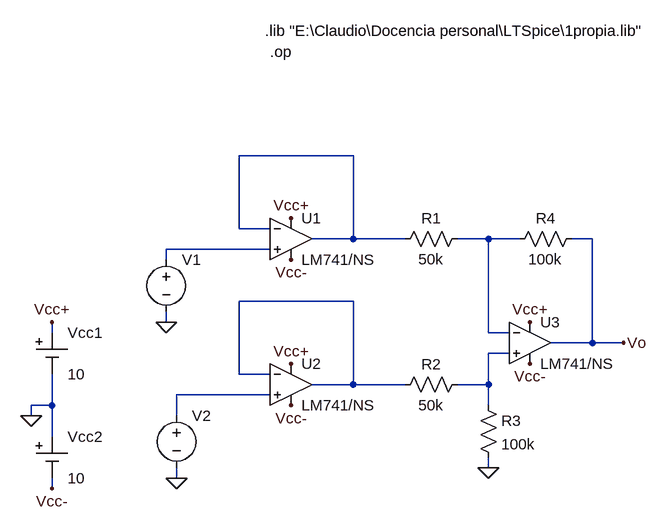
[diagram p0: schematic p2e1.asc]
p2e1.asc, the LTspice schematic file:
Version 4
SHEET 1 1508 1252
WIRE 352 -192 176 -192
WIRE 176 -80 176 -192
WIRE 224 -80 176 -80
WIRE 352 -64 352 -192
WIRE 352 -64 288 -64
WIRE 432 -64 352 -64
WIRE 560 -64 512 -64
WIRE 608 -64 560 -64
WIRE 720 -64 688 -64
WIRE 224 -48 64 -48
WIRE 64 -32 64 -48
WIRE 352 32 176 32
WIRE 64 64 64 48
WIRE -112 80 -112 64
WIRE 560 80 560 -64
WIRE 592 80 560 80
WIRE 720 96 720 -64
WIRE 720 96 656 96
WIRE 768 96 720 96
WIRE 592 112 560 112
WIRE 176 144 176 32
WIRE 224 144 176 144
WIRE 352 160 352 32
WIRE 352 160 288 160
WIRE 432 160 352 160
WIRE 560 160 560 112
WIRE 560 160 512 160
WIRE 224 176 80 176
WIRE -112 192 -112 144
WIRE -112 192 -144 192
WIRE 560 192 560 160
WIRE -144 208 -144 192
WIRE 80 208 80 176
WIRE -112 240 -112 192
WIRE 560 288 560 272
WIRE 80 304 80 288
WIRE -112 320 -112 304
FLAG -144 208 0
FLAG -112 64 Vcc+
FLAG -112 320 Vcc-
FLAG 256 -32 Vcc-
FLAG 256 -96 Vcc+
FLAG 256 128 Vcc+
FLAG 256 192 Vcc-
FLAG 624 128 Vcc-
FLAG 624 64 Vcc+
FLAG 560 288 0
FLAG 768 96 Vo
FLAG 64 64 0
FLAG 80 304 0
SYMBOL OpAmps\\opamp2 256 -128 R0
SYMATTR InstName U1
SYMATTR Value LM741/NS
SYMBOL OpAmps\\opamp2 256 96 R0
SYMATTR InstName U2
SYMATTR Value LM741/NS
SYMBOL Misc\\cell -112 80 R0
WINDOW 123 0 0 Left 0
WINDOW 39 0 0 Left 0
SYMATTR InstName Vcc1
SYMATTR Value 10
SYMBOL Misc\\cell -112 240 R0
WINDOW 123 0 0 Left 0
WINDOW 39 0 0 Left 0
SYMATTR InstName Vcc2
SYMATTR Value 10
SYMBOL res 528 -80 R90
WINDOW 0 0 56 VBottom 2
WINDOW 3 32 56 VTop 2
SYMATTR InstName R1
SYMATTR Value 50k
SYMBOL res 528 144 R90
WINDOW 0 0 56 VBottom 2
WINDOW 3 32 56 VTop 2
SYMATTR InstName R2
SYMATTR Value 50k
SYMBOL OpAmps\\opamp2 624 32 R0
SYMATTR InstName U3
SYMATTR Value LM741/NS
SYMBOL res 544 176 R0
SYMATTR InstName R3
SYMATTR Value 100k
SYMBOL res 704 -80 R90
WINDOW 0 0 56 VBottom 2
WINDOW 3 32 56 VTop 2
SYMATTR InstName R4
SYMATTR Value 100k
SYMBOL voltage 64 -48 R0
WINDOW 3 24 96 Invisible 2
WINDOW 123 0 0 Left 0
WINDOW 39 0 0 Left 0
SYMATTR Value 1
SYMATTR InstName V1
SYMBOL voltage 80 192 R0
WINDOW 3 24 96 Invisible 2
WINDOW 123 0 0 Left 0
WINDOW 39 0 0 Left 0
SYMATTR Value 2
SYMATTR InstName V2
TEXT 216 -384 Left 2 !.lib "E:\\Claudio\\Docencia personal\\LTSpice\\1propia.lib"
TEXT 224 -352 Left 2 !.op

The netlist it stands for:
* p2e1.asc
XU1 N003 N001 Vcc+ Vcc- N001 LM741/NS  ; pins In+ In- V+ V- OUT
XU2 N006 N004 Vcc+ Vcc- N004 LM741/NS  ; pins In+ In- V+ V- OUT
Vcc1 Vcc+ 0 10
Vcc2 0 Vcc- 10
R1 N002 N001 50k
R2 N005 N004 50k
XU3 N005 N002 Vcc+ Vcc- Vo LM741/NS  ; pins In+ In- V+ V- OUT
R3 N005 0 100k
R4 Vo N002 100k
V1 N003 0 1
V2 N006 0 2
.lib "E:\Claudio\Docencia personal\LTSpice\1propia.lib"
.op
.backanno
.end